# Altium schematic sheet Bidirectional Voltage Translator.SchDoc: 3V3 - 1V8 Voltage Level Translator
size A2; DocumentNumber: 11; SheetNumber: 11; SheetTotal: 54
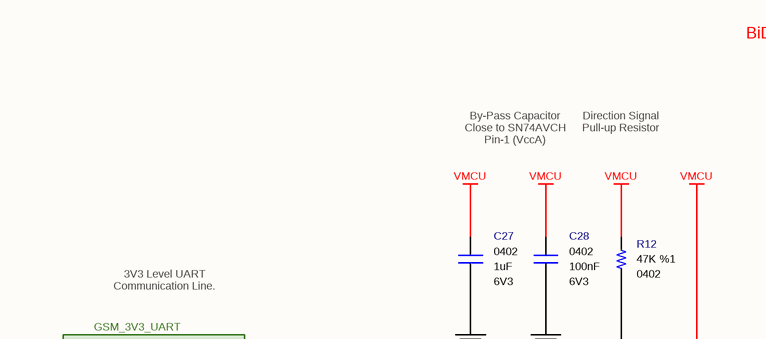
[diagram p0: Bidirectional Voltage Translator.SchDoc, top left]
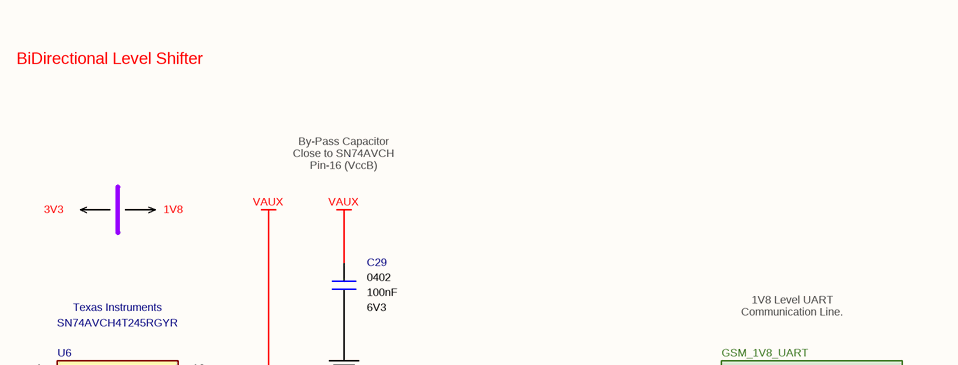
[diagram p1: Bidirectional Voltage Translator.SchDoc, top right]
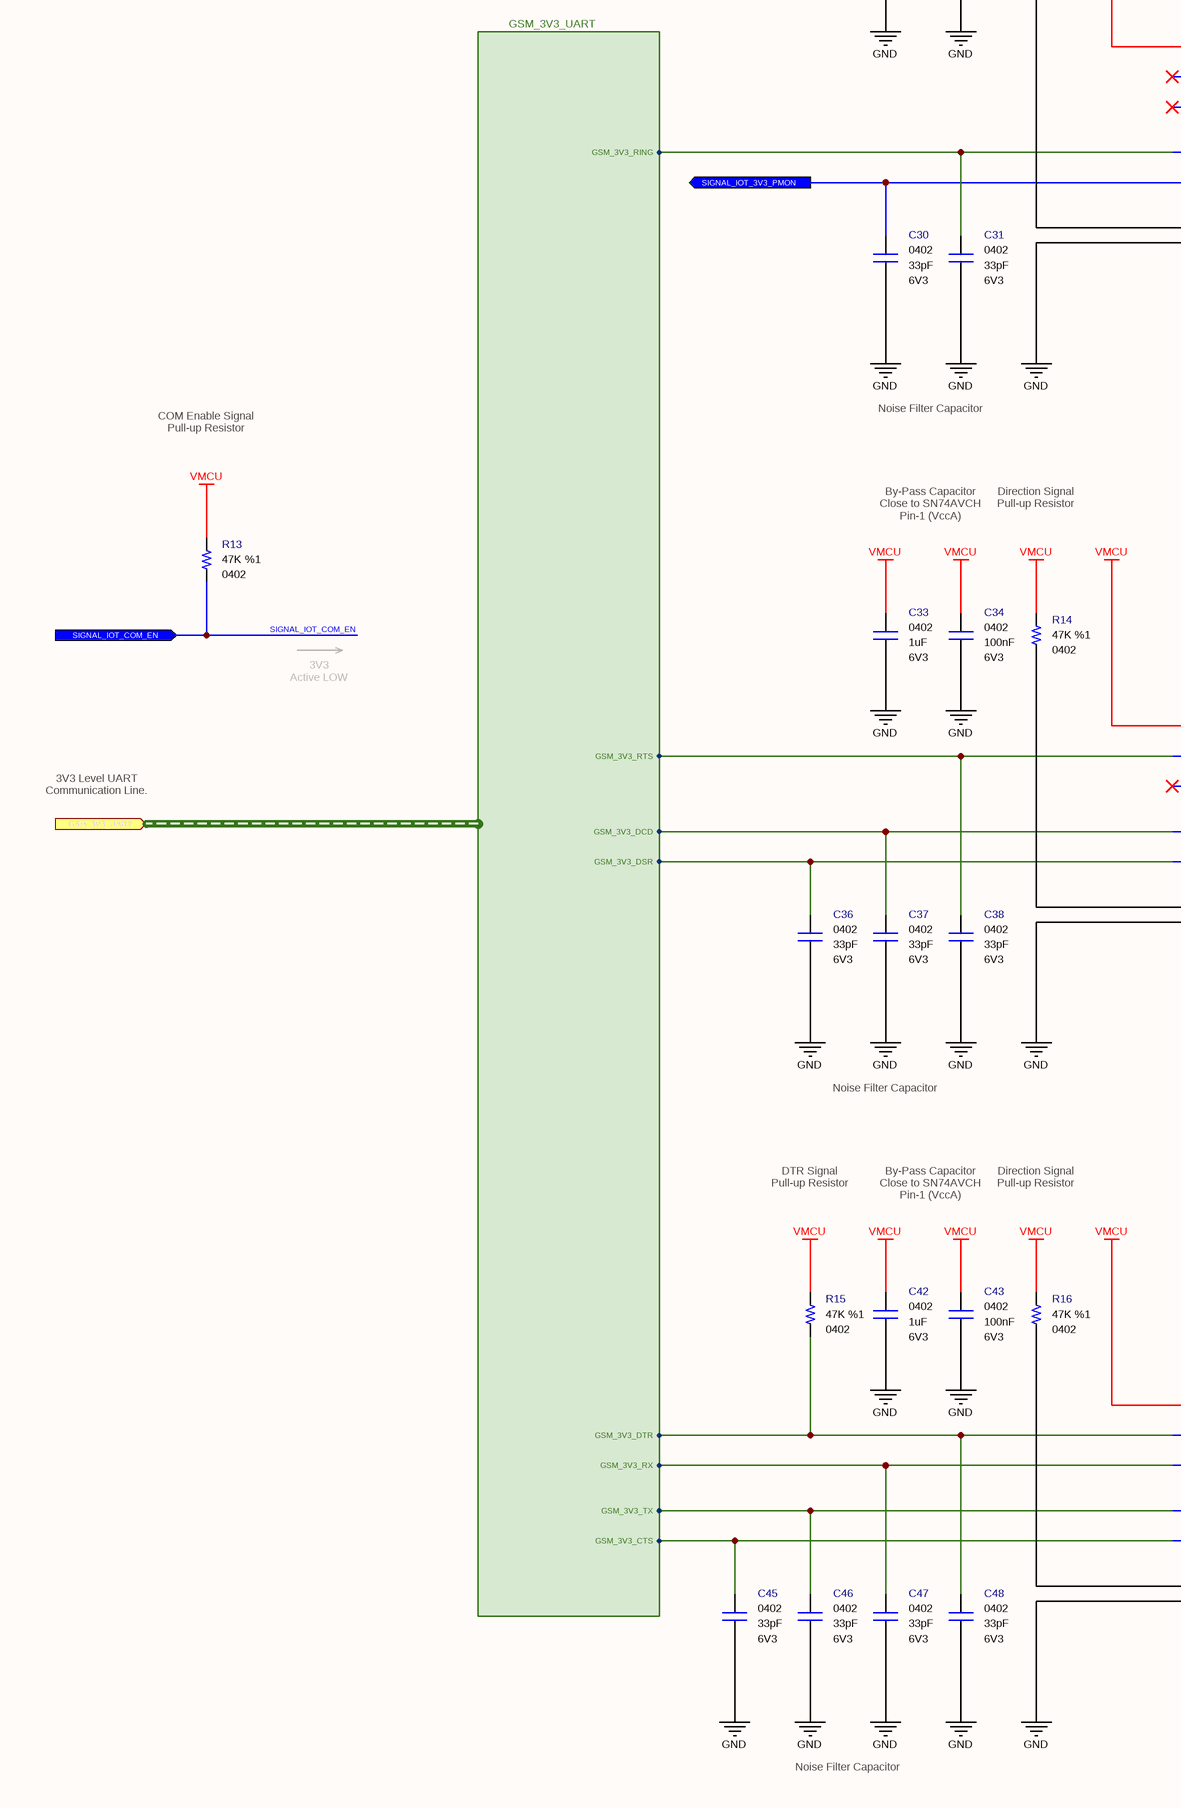
[diagram p2: Bidirectional Voltage Translator.SchDoc, bottom left]
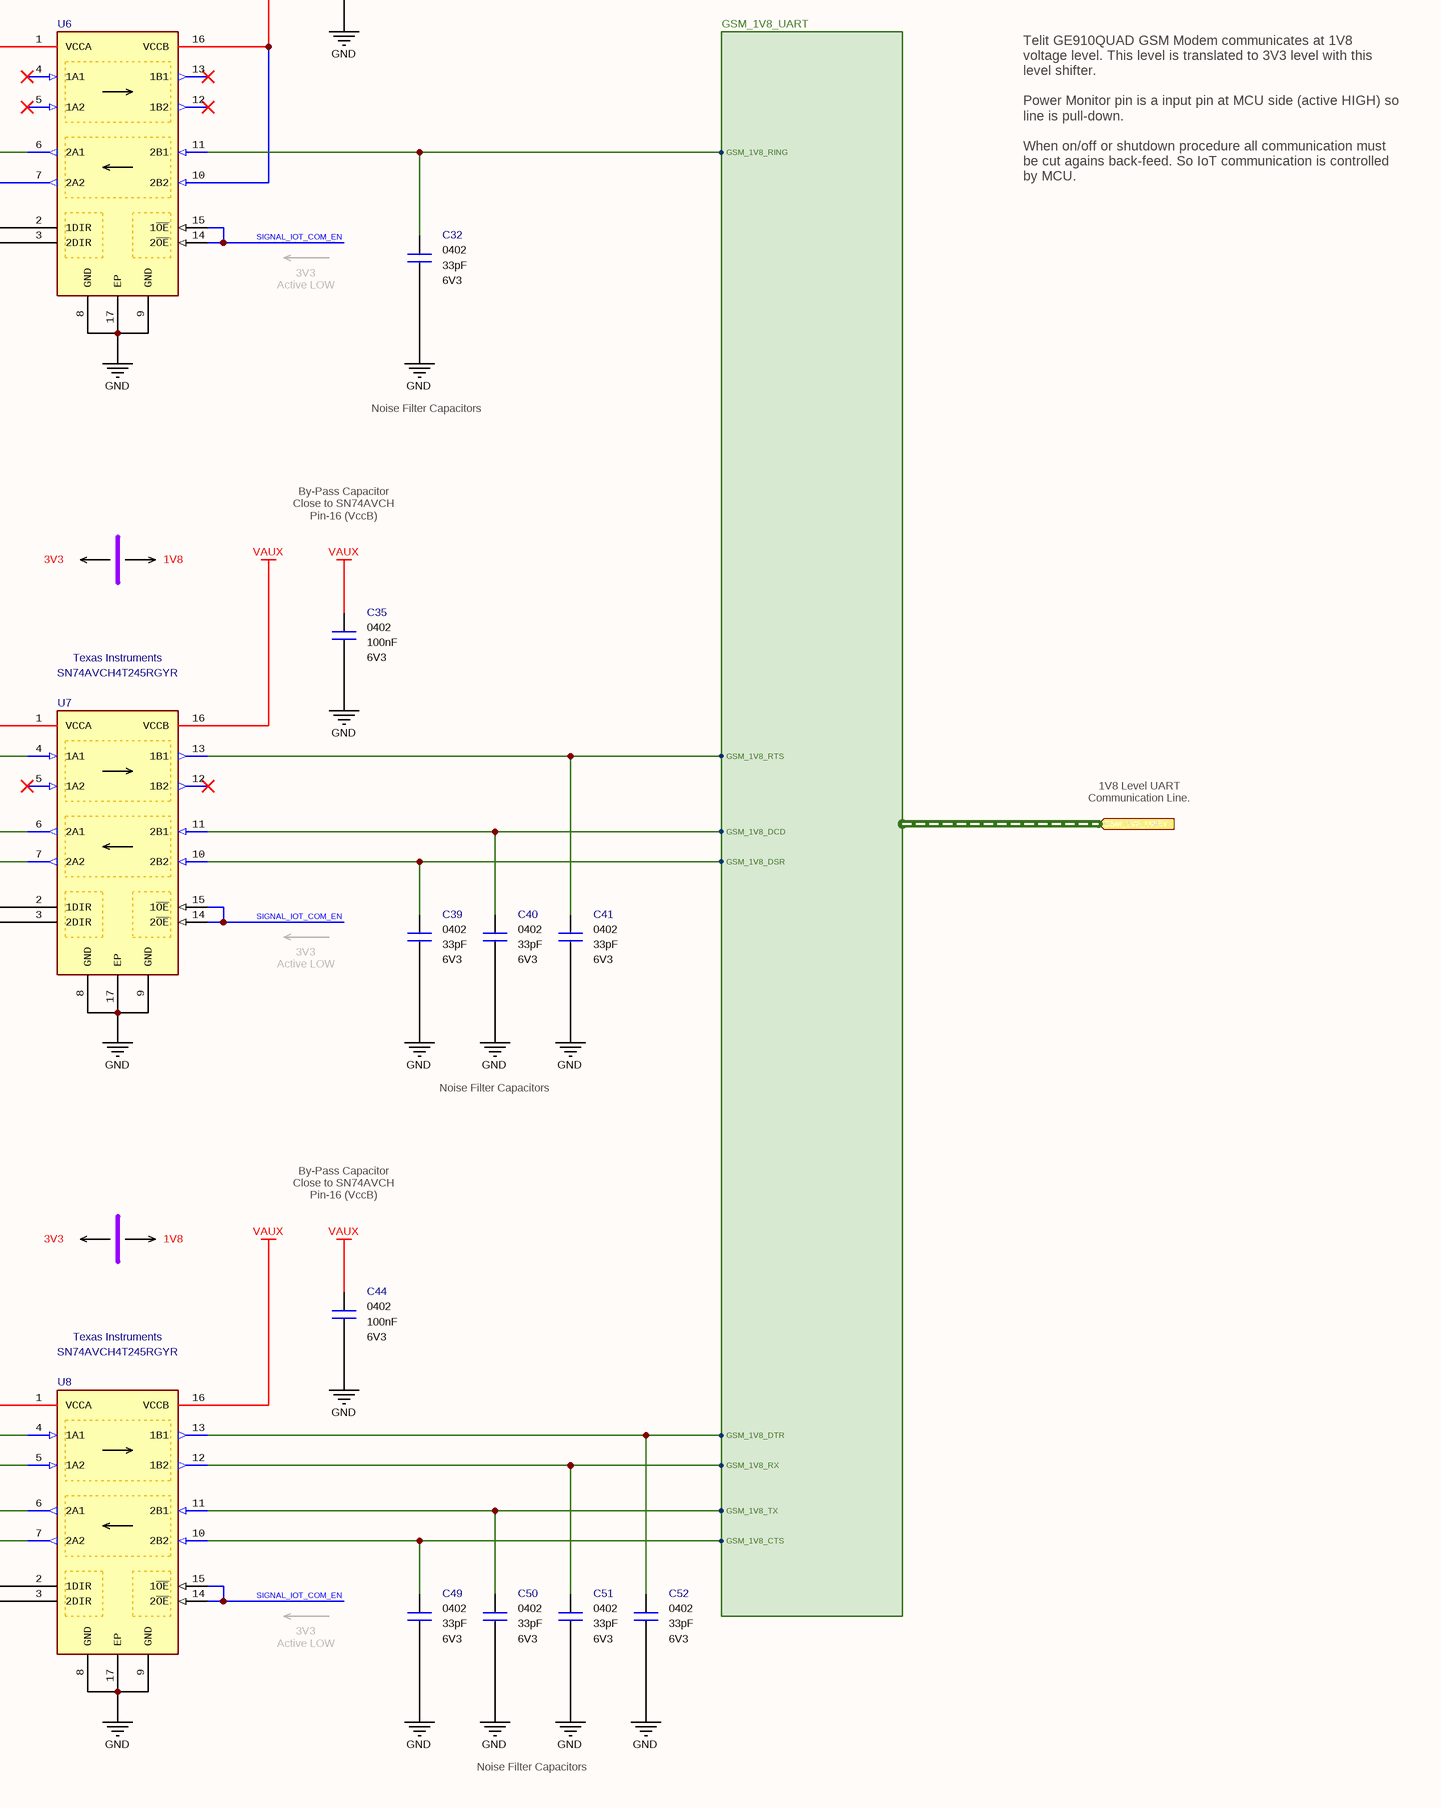
[diagram p3: Bidirectional Voltage Translator.SchDoc, bottom right]

## Parts
C27  value 1uF  Case: 0402  Voltage: 6V3  [CAPACITOR_0402]  (hidden comment: Multilayer Ceramic Capacitor)
C28  value 100nF  Case: 0402  Voltage: 6V3  [CAPACITOR_0402]  (hidden comment: Multilayer Ceramic Capacitor)
C29  value 100nF  Case: 0402  Voltage: 6V3  [CAPACITOR_0402]  (hidden comment: Multilayer Ceramic Capacitor)
C30  value 33pF  Case: 0402  Voltage: 6V3  [CAPACITOR_0402]  (hidden comment: Multilayer Ceramic Capacitor)
C31  value 33pF  Case: 0402  Voltage: 6V3  [CAPACITOR_0402]  (hidden comment: Multilayer Ceramic Capacitor)
C32  value 33pF  Case: 0402  Voltage: 6V3  [CAPACITOR_0402]  (hidden comment: Multilayer Ceramic Capacitor)
C33  value 1uF  Case: 0402  Voltage: 6V3  [CAPACITOR_0402]  (hidden comment: Multilayer Ceramic Capacitor)
C34  value 100nF  Case: 0402  Voltage: 6V3  [CAPACITOR_0402]  (hidden comment: Multilayer Ceramic Capacitor)
C35  value 100nF  Case: 0402  Voltage: 6V3  [CAPACITOR_0402]  (hidden comment: Multilayer Ceramic Capacitor)
C36  value 33pF  Case: 0402  Voltage: 6V3  [CAPACITOR_0402]  (hidden comment: Multilayer Ceramic Capacitor)
C37  value 33pF  Case: 0402  Voltage: 6V3  [CAPACITOR_0402]  (hidden comment: Multilayer Ceramic Capacitor)
C38  value 33pF  Case: 0402  Voltage: 6V3  [CAPACITOR_0402]  (hidden comment: Multilayer Ceramic Capacitor)
C39  value 33pF  Case: 0402  Voltage: 6V3  [CAPACITOR_0402]  (hidden comment: Multilayer Ceramic Capacitor)
C40  value 33pF  Case: 0402  Voltage: 6V3  [CAPACITOR_0402]  (hidden comment: Multilayer Ceramic Capacitor)
C41  value 33pF  Case: 0402  Voltage: 6V3  [CAPACITOR_0402]  (hidden comment: Multilayer Ceramic Capacitor)
C42  value 1uF  Case: 0402  Voltage: 6V3  [CAPACITOR_0402]  (hidden comment: Multilayer Ceramic Capacitor)
C43  value 100nF  Case: 0402  Voltage: 6V3  [CAPACITOR_0402]  (hidden comment: Multilayer Ceramic Capacitor)
C44  value 100nF  Case: 0402  Voltage: 6V3  [CAPACITOR_0402]  (hidden comment: Multilayer Ceramic Capacitor)
C45  value 33pF  Case: 0402  Voltage: 6V3  [CAPACITOR_0402]  (hidden comment: Multilayer Ceramic Capacitor)
C46  value 33pF  Case: 0402  Voltage: 6V3  [CAPACITOR_0402]  (hidden comment: Multilayer Ceramic Capacitor)
C47  value 33pF  Case: 0402  Voltage: 6V3  [CAPACITOR_0402]  (hidden comment: Multilayer Ceramic Capacitor)
C48  value 33pF  Case: 0402  Voltage: 6V3  [CAPACITOR_0402]  (hidden comment: Multilayer Ceramic Capacitor)
C49  value 33pF  Case: 0402  Voltage: 6V3  [CAPACITOR_0402]  (hidden comment: Multilayer Ceramic Capacitor)
C50  value 33pF  Case: 0402  Voltage: 6V3  [CAPACITOR_0402]  (hidden comment: Multilayer Ceramic Capacitor)
C51  value 33pF  Case: 0402  Voltage: 6V3  [CAPACITOR_0402]  (hidden comment: Multilayer Ceramic Capacitor)
C52  value 33pF  Case: 0402  Voltage: 6V3  [CAPACITOR_0402]  (hidden comment: Multilayer Ceramic Capacitor)
R12  value 47K  Tolerance: %1  Case: 0402  [RESISTOR_0402]  (hidden comment: 47K - 0402 - %1 - 1/16W)
R13  value 47K  Tolerance: %1  Case: 0402  [RESISTOR_0402]  (hidden comment: 47K - 0402 - %1 - 1/16W)
R14  value 47K  Tolerance: %1  Case: 0402  [RESISTOR_0402]  (hidden comment: 47K - 0402 - %1 - 1/16W)
R15  value 47K  Tolerance: %1  Case: 0402  [RESISTOR_0402]  (hidden comment: 47K - 0402 - %1 - 1/16W)
R16  value 47K  Tolerance: %1  Case: 0402  [RESISTOR_0402]  (hidden comment: 47K - 0402 - %1 - 1/16W)
U6  Manufacturer Part Number: SN74AVCH4T245RGYR  Manufacturer Name: Texas Instruments  [VQFN16]  (hidden comment: Voltage Level Shifter)
U7  Manufacturer Part Number: SN74AVCH4T245RGYR  Manufacturer Name: Texas Instruments  [VQFN16]  (hidden comment: Voltage Level Shifter)
U8  Manufacturer Part Number: SN74AVCH4T245RGYR  Manufacturer Name: Texas Instruments  [VQFN16]  (hidden comment: Voltage Level Shifter)

## Ports
GSM_1V8_UART (in, harness GSM_1V8_UART), GSM_3V3_UART (in, harness GSM_3V3_UART), SIGNAL_IOT_3V3_PMON (out), SIGNAL_IOT_COM_EN (in)

## Harnesses
GSM_3V3_UART: GSM_3V3_RX, GSM_3V3_TX, GSM_3V3_DTR, GSM_3V3_RTS, GSM_3V3_CTS, GSM_3V3_DCD, GSM_3V3_DSR, GSM_3V3_RING
GSM_1V8_UART: GSM_1V8_RX, GSM_1V8_TX, GSM_1V8_DTR, GSM_1V8_RTS, GSM_1V8_CTS, GSM_1V8_DCD, GSM_1V8_DSR, GSM_1V8_RING

## Nets
GND: C27.1 C28.1 C29.1 C30.1 C31.1 C32.1 C33.1 C34.1 C35.1 C36.1 C37.1 C38.1 C39.1 C40.1 C41.1 C42.1 C43.1 C44.1 C45.1 C46.1 C47.1 C48.1 C49.1 C50.1 C51.1 C52.1 U6.3(2DIR) U6.8(GND) U6.9(GND) U6.17(EP) U7.3(2DIR) U7.8(GND) U7.9(GND) U7.17(EP) U8.3(2DIR) U8.8(GND) U8.9(GND) U8.17(EP)
VAUX: C29.2 C35.2 C44.2 U6.10(2B2) U6.16(VCCB) U7.16(VCCB) U8.16(VCCB)
VMCU: C27.2 C28.2 C33.2 C34.2 C42.2 C43.2 R12.2 R13.2 R14.2 R15.2 R16.2 U6.1(VCCA) U7.1(VCCA) U8.1(VCCA)
SIGNAL_IOT_3V3_PMON: C30.2 U6.7(2A2) ; port SIGNAL_IOT_3V3_PMON
SIGNAL_IOT_COM_EN: R13.1 U6.14(2~{OE}) U6.15(1~{OE}) U7.14(2~{OE}) U7.15(1~{OE}) U8.14(2~{OE}) U8.15(1~{OE}) ; port SIGNAL_IOT_COM_EN
NetC31_2: C31.2 U6.6(2A1) ; port GSM_3V3_UART.GSM_3V3_RING
NetC32_2: C32.2 U6.11(2B1) ; port GSM_1V8_UART.GSM_1V8_RING
NetC36_2: C36.2 U7.7(2A2) ; port GSM_3V3_UART.GSM_3V3_DSR
NetC37_2: C37.2 U7.6(2A1) ; port GSM_3V3_UART.GSM_3V3_DCD
NetC38_2: C38.2 U7.4(1A1) ; port GSM_3V3_UART.GSM_3V3_RTS
NetC39_2: C39.2 U7.10(2B2) ; port GSM_1V8_UART.GSM_1V8_DSR
NetC40_2: C40.2 U7.11(2B1) ; port GSM_1V8_UART.GSM_1V8_DCD
NetC41_2: C41.2 U7.13(1B1) ; port GSM_1V8_UART.GSM_1V8_RTS
NetC45_2: C45.2 U8.7(2A2) ; port GSM_3V3_UART.GSM_3V3_CTS
NetC46_2: C46.2 U8.6(2A1) ; port GSM_3V3_UART.GSM_3V3_TX
NetC47_2: C47.2 U8.5(1A2) ; port GSM_3V3_UART.GSM_3V3_RX
NetC48_2: C48.2 R15.1 U8.4(1A1) ; port GSM_3V3_UART.GSM_3V3_DTR
NetC49_2: C49.2 U8.10(2B2) ; port GSM_1V8_UART.GSM_1V8_CTS
NetC50_2: C50.2 U8.11(2B1) ; port GSM_1V8_UART.GSM_1V8_TX
NetC51_2: C51.2 U8.12(1B2) ; port GSM_1V8_UART.GSM_1V8_RX
NetC52_2: C52.2 U8.13(1B1) ; port GSM_1V8_UART.GSM_1V8_DTR
NetR12_1: R12.1 U6.2(1DIR)
NetR14_1: R14.1 U7.2(1DIR)
NetR16_1: R16.1 U8.2(1DIR)

Not connected (* = marked no-connect by the designer): U6 4(1A1)* 5(1A2)* 12(1B2)* 13(1B1)*; U7 5(1A2)* 12(1B2)*

## Notes on the sheet
- BiDirectional Level Shifter
- By-Pass Capacitor
  Close to SN74AVCH
  Pin-1 (VccA)
- Direction Signal
  Pull-up Resistor
- 3V3
- 1V8
- By-Pass Capacitor
  Close to SN74AVCH
  Pin-16 (VccB)
- 3V3 Level UART Communication Line.
- 1V8 Level UART Communication Line.
- Telit GE910QUAD GSM Modem communicates at 1V8 voltage level. This level is translated to 3V3 level with this  level shifter.
  Power Monitor pin is a input pin at MCU side (active HIGH) so line is pull-down.
  When on/off or shutdown procedure all communication must be cut agains back-feed. So IoT communication is controlled by MCU.
- 3V3
  Active LOW
- Noise Filter Capacitor
- Noise Filter Capacitors
- COM Enable Signal
  Pull-up Resistor
- DTR Signal
  Pull-up Resistor
- Engineer
- Customer
- All Rights are reserved to Customer and Engineer. [2021]
- Size:
- Date:
- File:
- A2
- Project :
- Time:
- Sheet
- of
- Product ID
- Module ID
- Version
- Revision

## Library data of the parts
C27 C33 C42 = Capacitor - 1uF [0402-6V3]: Capacitor - 1uF [0402] (Ceramic); Manufacturer Name: Murata Electronics; Manufacturer Part Number: GRM153R60J105ME95D; Dielectric: X5R; Tolerance: 20%; Height: 0.3mm; Maximum Operating Temperature: +85; Minimum Operating Temperature: -55; RoHS: Yes; Weight: 6mg; ComponentLink1Description: DataSheet; ComponentLink1URL: https://psearch.en.murata.com/capacitor/product/GRM153R60J105ME95%23.html; ComponentLink2Description: Mouser; ComponentLink2URL: https://www.mouser.com/Search/Refine.aspx?Keyword=81-GRM153R60J105ME5D; Supplier 1: Future Electronics; Supplier 2: Future Electronics; Supplier 3: Mouser; Supplier 4: Arrow; Supplier 5: Digi-Key; Supplier Part Number 5: 490-14576-1-ND; Supplier Part Number 4: GRM153R60J105ME95D; Supplier Part Number 3: 81-GRM153R60J105ME5D; Supplier Part Number 2: GRM153R60J105ME95D-REEL; Supplier Part Number 1: GRM153R60J105ME95D-CUTT; Mouser Part Number: 81-GRM153R60J105ME5D
C28 C29 C34 C35 C43 C44 = Capacitor - 100nF [0402-6V3]: Capacitor - 100nF [0402-6V3] (Ceramic); Manufacturer Name: AVX; Manufacturer Part Number: 04026D104KAT4A; Dielectric: X5R; Tolerance: %10; Height: 0.25mm; ComponentLink1Description: Mouser; ComponentLink1URL: https://www.mouser.com.tr/ProductDetail/AVX/04026D104KAT4A?qs=sGAEpiMZZMs0AnBnWHyRQPg4iYkCw7IMED%2F4kpqgf7w%3D; ComponentLink2Description: DataSheet; ComponentLink2URL: https://www.mouser.com.tr/datasheet/2/40/cx5r-776519.pdf; ROHS: Yes; Maximum Operating Temperature: +85; Minimum Operating Temperature: -55; Supplier 1: Avnet; Supplier Part Number 1: 04026D104KAT4A; Mouser Part Number: 581-04026D104KAT4A
C30-C32 C36-C41 C45-C52 = Capacitor - 33pF [0402-6V3]: Capacitor - 33pF [0402] (Ceramic); Manufacturer Name: Kemet; Manufacturer Part Number: C0402C330J9RACAUTO; Dielectric: X7R; Tolerance: 10%; Height: 0.5mm; Maximum Operating Temperature: +125; Minimum Operating Temperature: -55; ROHS: Yes; ComponentLink1Description: DataSheet; ComponentLink1URL: https://api.kemet.com/component-edge/download/datasheet/C0402C330J9RACAUTO.pdf; ComponentLink2Description: Mouser; ComponentLink2URL: https://www.mouser.com/Search/Refine.aspx?Keyword=80-C0402C330J9RAUTO; Supplier 1: Mouser; Supplier Part Number 1: 80-C0402C330J9RAUTO; Mouser Part Number: 80-C0402C330J9RAUTO
R12-R16 = Resistor - 47K: Thick Film Resistors - SMD 1/16 W 47 Kohms 1%; Manufacturer Name: Vishay; Manufacturer Part Number: CRCW040247K0FKED; Height: 0.4mm; ComponentLink1Description: DataSheet; ComponentLink1URL: https://www.mouser.com.tr/datasheet/2/427/dcrcwe3-1762152.pdf; ComponentLink2Description: Mouser; ComponentLink2URL: https://www.mouser.com.tr/ProductDetail/Vishay-Dale/CRCW040247K0FKED?qs=sGAEpiMZZMu61qfTUdNhG2DpbjADlD3GL%252B3h1elTxqU%3D; Supplier 1: RSComponents; Supplier 2: Newark; Supplier Part Number 1: 6789361P; Supplier Part Number 2: 52K7097; Supplier 3: Avnet; Supplier 4: RSComponents; Supplier 5: Future Electronics; Supplier 6: Future Electronics; Supplier 7: Newark; Supplier 8: Arrow Electronics; Supplier 9: Mouser; Supplier 10: Newark; Supplier 11: Avnet; Supplier 12: Digi-Key; Supplier 13: Digi-Key; Supplier 14: Digi-Key; Supplier 15: Newark; Supplier 16: Farnell; Supplier 17: Farnell; Supplier 18: Farnell; Supplier 19: Allied Electronics; Supplier 20: Allied Electronics; Supplier 21: Avnet; Supplier 22: Future Electronics; Supplier 23: Future Electronics; Supplier 24: Future Electronics; Supplier 25: Newark; Supplier 26: RSComponents; Supplier 27: RSComponents; Supplier Part Number 3: 52K7097; Supplier Part Number 4: 6789361; Supplier Part Number 5: 2103738; Supplier Part Number 6: 7521222; Supplier Part Number 7: 42K3500; Supplier Part Number 8: CRCW040247K0FKED; Supplier Part Number 12: 541-47.0KLCT-ND; Supplier Part Number 14: 541-47.0KLTR-ND; Supplier Part Number 10: 61M5310; Supplier Part Number 9: 71-CRCW0402-47K-E3; Supplier Part Number 13: 541-47.0KLDKR-ND; Supplier Part Number 11: CRCW040247K0FKED; Supplier Part Number 15: 25AC7165; Supplier Part Number 16: 1469719; Supplier Part Number 18: 2121814; Supplier Part Number 17: 1469719RL; Supplier Part Number 19: 70202660; Supplier Part Number 20: 70272767; Supplier Part Number 21: 42K3500; Supplier Part Number 22: 6128776; Supplier Part Number 24: CRCW040247K0FKED-REEL; Supplier Part Number 23: CRCW040247K0FKED-CUTT; Supplier Part Number 25: 24W2315; Supplier Part Number 26: 1688455; Supplier Part Number 27: 1823505
U6-U8 = IC - SN74AVCH4T245: Translation - Voltage Levels Low Power Dual Channel; Supply Voltage - Max: 3.6V; Supply Voltage - Min: 1.2V; Height: 1mm; ComponentLink1Description: DataSheet; ComponentLink1URL: http://www.ti.com/general/docs/suppproductinfo.tsp?distId=26&gotoUrl=http%3A%2F%2Fwww.ti.com%2Flit%2Fgpn%2Fsn74avch4t245; Maximum Operating Temperature: +85; Minimum Operating Temperature: -40; ComponentLink2Description: Mouser; ComponentLink2URL: https://www.mouser.com.tr/ProductDetail/Texas-Instruments/SN74AVCH4T245RGYR?qs=PVVDbbWpW3IMTHF1QV2g%252BQ==; Supplier 1: Mouser; Supplier 2: Arrow; Supplier 3: Digi-Key; Supplier Part Number 1: 595-SN74AVCH4T245RGY; Supplier Part Number 2: SN74AVCH4T245RGYR; Supplier Part Number 3: 296-18262-1-ND; Case: VQFN-16; Mouser Part Number: 595-SN74AVCH4T245RGY